# Altium schematic sheet SpoolBot_drive_PCB.SchDoc
size A; DocumentNumber: 1; SheetNumber: 1; SheetTotal: 5
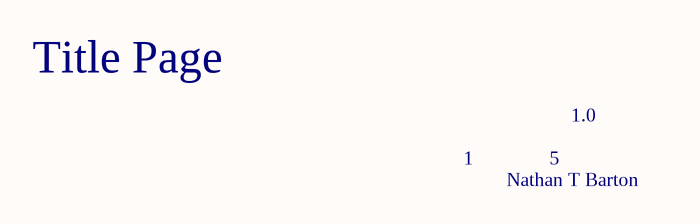
[diagram p0: SpoolBot_drive_PCB.SchDoc]

## Notes on the sheet
- Title Page
- 1
- 5
- 1.0
- Nathan T Barton